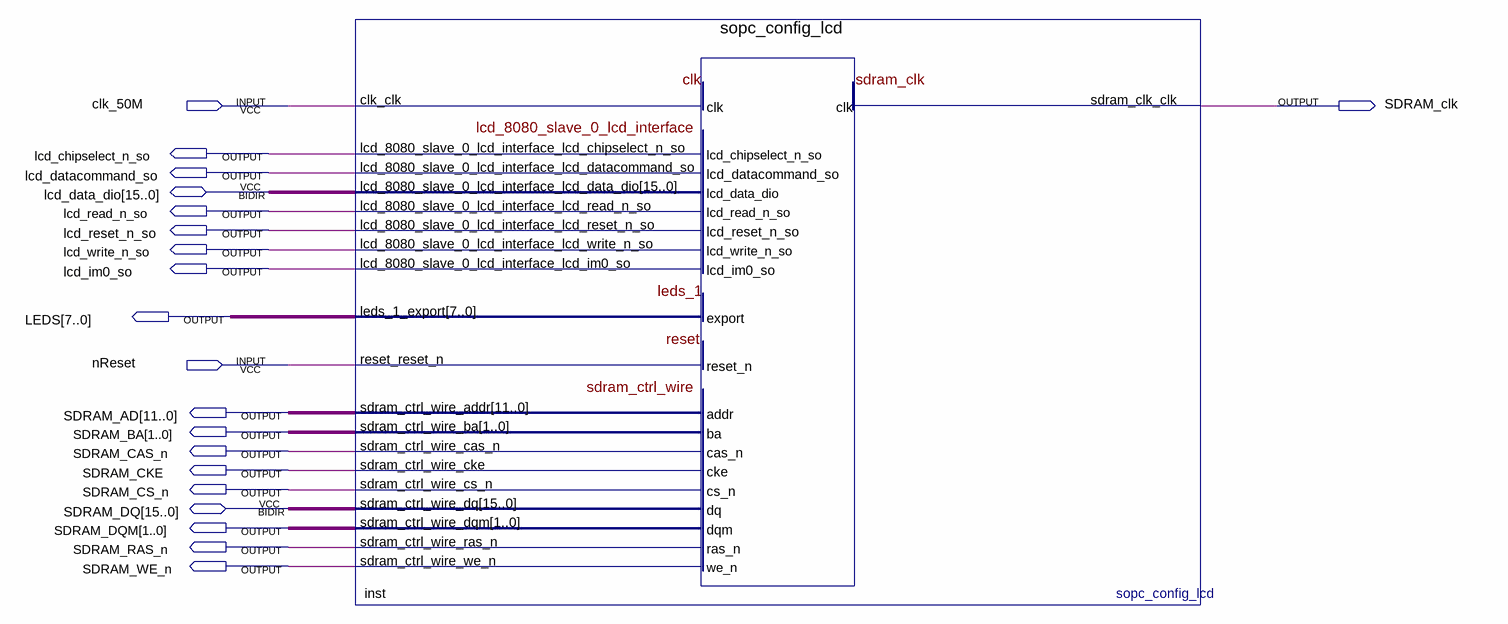
[diagram p0: schematic sheet]
// Quartus schematic niosIISOPC.bdf as structural Verilog: 1 symbols, 20 pins
module niosIISOPC (
  input  clk_50M,
  input  nReset,
  inout  [15:0] lcd_data_dio,
  inout  [15:0] SDRAM_DQ,
  output SDRAM_clk,
  output lcd_chipselect_n_so,
  output lcd_datacommand_so,
  output lcd_read_n_so,
  output lcd_reset_n_so,
  output lcd_write_n_so,
  output lcd_im0_so,
  output [7:0] LEDS,
  output [11:0] SDRAM_AD,
  output [1:0] SDRAM_BA,
  output SDRAM_CAS_n,
  output SDRAM_CKE,
  output SDRAM_CS_n,
  output [1:0] SDRAM_DQM,
  output SDRAM_RAS_n,
  output SDRAM_WE_n
);

  sopc_config_lcd inst (
    .clk_clk(clk_50M), .reset_reset_n(nReset),
    .lcd_8080_slave_0_lcd_interface_lcd_chipselect_n_so(lcd_chipselect_n_so),
    .lcd_8080_slave_0_lcd_interface_lcd_datacommand_so(lcd_datacommand_so),
    .lcd_8080_slave_0_lcd_interface_lcd_read_n_so(lcd_read_n_so),
    .lcd_8080_slave_0_lcd_interface_lcd_reset_n_so(lcd_reset_n_so),
    .lcd_8080_slave_0_lcd_interface_lcd_write_n_so(lcd_write_n_so),
    .lcd_8080_slave_0_lcd_interface_lcd_im0_so(lcd_im0_so), .sdram_clk_clk(SDRAM_clk),
    .sdram_ctrl_wire_addr(SDRAM_AD), .sdram_ctrl_wire_ba(SDRAM_BA), .sdram_ctrl_wire_cas_n(SDRAM_CAS_n),
    .sdram_ctrl_wire_cke(SDRAM_CKE), .sdram_ctrl_wire_cs_n(SDRAM_CS_n), .sdram_ctrl_wire_dqm(SDRAM_DQM),
    .sdram_ctrl_wire_ras_n(SDRAM_RAS_n), .sdram_ctrl_wire_we_n(SDRAM_WE_n),
    .lcd_8080_slave_0_lcd_interface_lcd_data_dio(lcd_data_dio), .leds_1_export(LEDS),
    .sdram_ctrl_wire_dq(SDRAM_DQ));
endmodule
